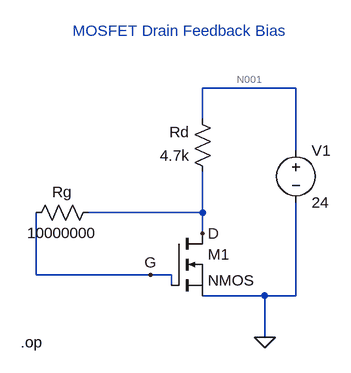
[diagram p0: schematic mosfet drain feedback.asc]
mosfet drain feedback.asc, the LTspice schematic file:
Version 4
SHEET 1 880 680
WIRE 352 -112 208 -112
WIRE 208 -64 208 -112
WIRE 352 -16 352 -112
WIRE 208 80 208 16
WIRE 208 80 32 80
WIRE 208 112 208 80
WIRE -48 176 -48 80
WIRE 128 176 -48 176
WIRE 160 176 128 176
WIRE 160 192 160 176
WIRE 304 208 208 208
WIRE 352 208 352 64
WIRE 352 208 304 208
WIRE 304 272 304 208
FLAG 128 176 G
FLAG 208 112 D
FLAG 304 272 0
SYMBOL nmos 160 112 R0
SYMATTR InstName M1
SYMBOL res 48 64 R90
WINDOW 0 0 56 VBottom 2
WINDOW 3 32 56 VTop 2
SYMATTR InstName Rg
SYMATTR Value 10000000
SYMBOL res 224 32 R180
WINDOW 0 36 76 Left 2
WINDOW 3 36 40 Left 2
SYMATTR InstName Rd
SYMATTR Value 4.7k
SYMBOL voltage 352 -32 R0
WINDOW 123 0 0 Left 0
WINDOW 39 0 0 Left 0
SYMATTR InstName V1
SYMATTR Value 24
TEXT -72 280 Left 2 !.op
TEXT 8 -200 Left 2 ;MOSFET Drain Feedback Bias

The netlist it stands for:
* mosfet drain feedback.asc
M1 D G 0 0 NMOS
Rg D G 10000000
Rd D N001 4.7k
V1 N001 0 24
.model NMOS NMOS
.model PMOS PMOS
.lib standard.mos
.op
* MOSFET Drain Feedback Bias
.backanno
.end

* Results of the author's LTspice run, read from the files saved beside the schematic
* Operating Point:
*   V(d) = 14.34 V
*   V(g) = 14.34 V
*   V(n001) = 24 V
*   Id(M1) = 2.056 mA
*   Ig(M1) = 0 A
*   Ib(M1) = -14.35 pA
*   Is(M1) = -2.056 mA
*   I(Rd) = -2.056 mA
*   I(Rg) = 0 A
*   I(V1) = -2.056 mA
* From the log:
*   Semiconductor Device Operating Points:
*                           --- MOSFET Transistors ---
*   Name:          m1
*   Model:        nmos
*   Id:          2.06e-03
*   Vgs:         1.43e+01
*   Vds:         1.43e+01
*   Vbs:         0.00e+00
*   Vth:         0.00e+00
*   Vdsat:       1.43e+01
*   Gm:          2.87e-04
*   Gds:         0.00e+00
*   Gmb:         0.00e+00
*   Cbd:         0.00e+00
*   Cbs:         0.00e+00
*   Cgsov:       0.00e+00
*   Cgdov:       0.00e+00
*   Cgbov:       0.00e+00
*   Cgs:         0.00e+00
*   Cgd:         0.00e+00
*   Cgb:         0.00e+00